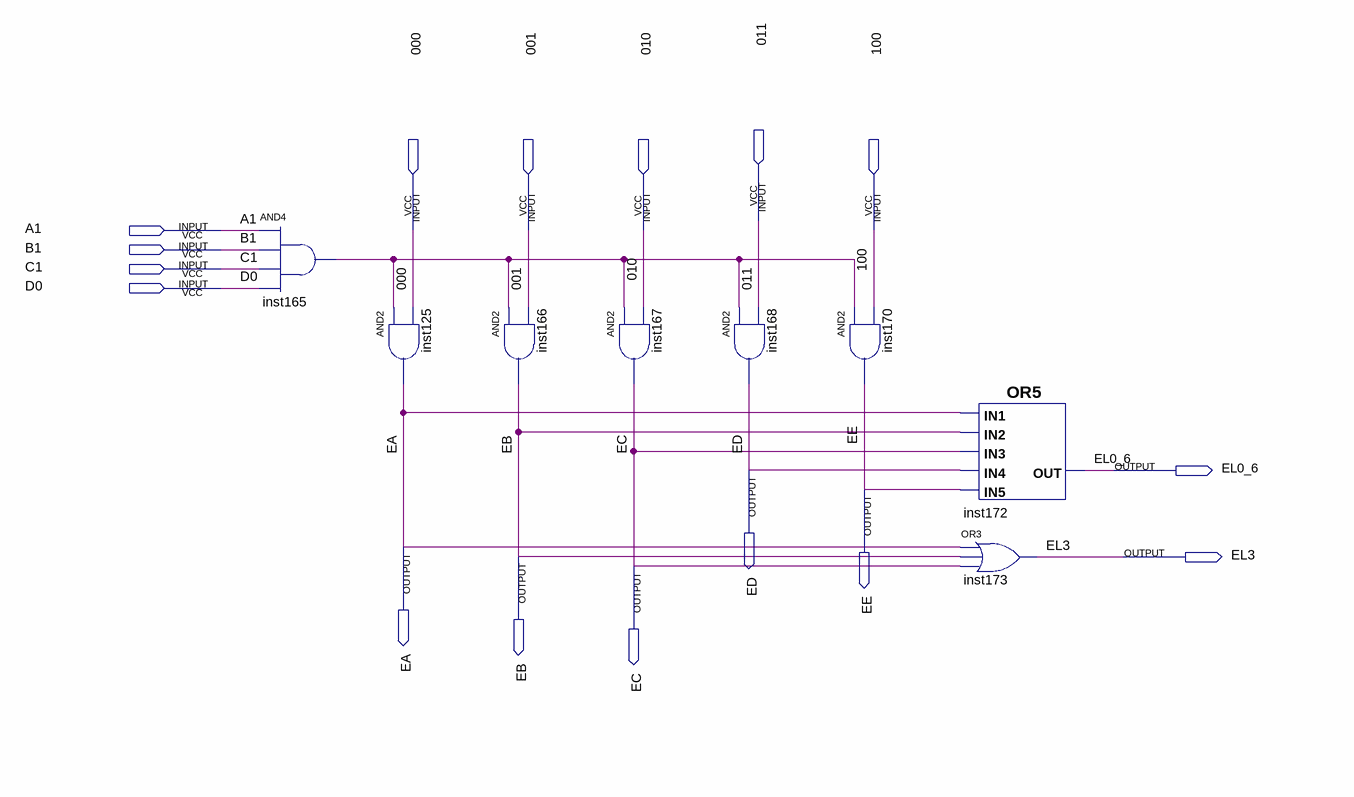
[diagram p0: schematic sheet]
// Quartus schematic caracE.bdf as structural Verilog: 8 symbols, 16 pins
module caracE (
  input  \011 ,
  input  A1,
  input  \000 ,
  input  \001 ,
  input  \010 ,
  input  \100 ,
  input  B1,
  input  C1,
  input  D0,
  output ED,
  output EL0_6,
  output EE,
  output EA,
  output EB,
  output EL3,
  output EC
);

  wire inst165_out;

  and inst165 (inst165_out, A1, B1, C1, D0);
  and inst125 (EA, inst165_out, \000 );
  and inst166 (EB, inst165_out, \001 );
  and inst167 (EC, inst165_out, \010 );
  and inst168 (ED, inst165_out, \011 );
  and inst170 (EE, inst165_out, \100 );
  or inst172 (EL0_6, EA, EB, EC, ED, EE);
  or inst173 (EL3, EA, EB, EC);
endmodule
